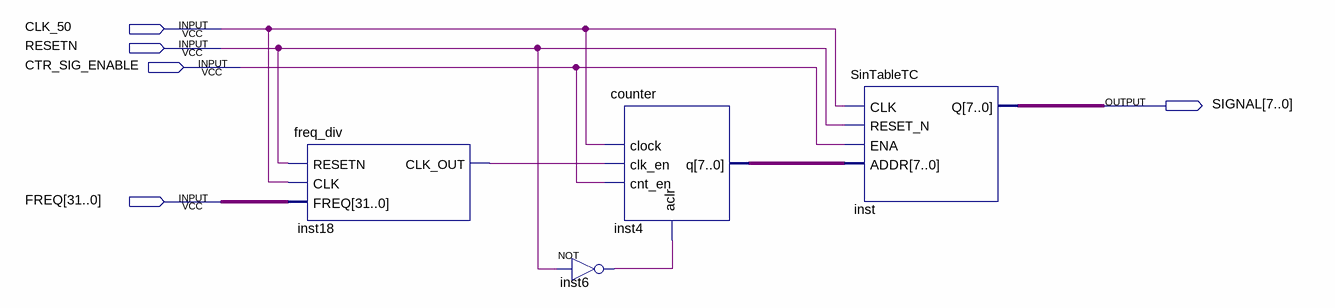
[diagram p0: schematic sheet]
// Quartus schematic Sig_Generator.bdf as structural Verilog: 4 symbols, 5 pins
module Sig_Generator (
  input  CLK_50,
  input  RESETN,
  input  CTR_SIG_ENABLE,
  input  [31:0] FREQ,
  output [7:0] SIGNAL
);

  wire inst6_out, inst18_clk_out;
  wire [7:0] inst4_q;

  freq_div inst18 (.RESETN(RESETN), .CLK(CLK_50), .FREQ(FREQ), .CLK_OUT(inst18_clk_out));
  counter inst4 (.aclr(inst6_out), .clk_en(inst18_clk_out), .clock(CLK_50), .cnt_en(CTR_SIG_ENABLE), .q(inst4_q));
  not inst6 (inst6_out, RESETN);
  SinTableTC inst (.CLK(CLK_50), .RESET_N(RESETN), .ENA(CTR_SIG_ENABLE), .ADDR(inst4_q), .Q(SIGNAL));
endmodule
